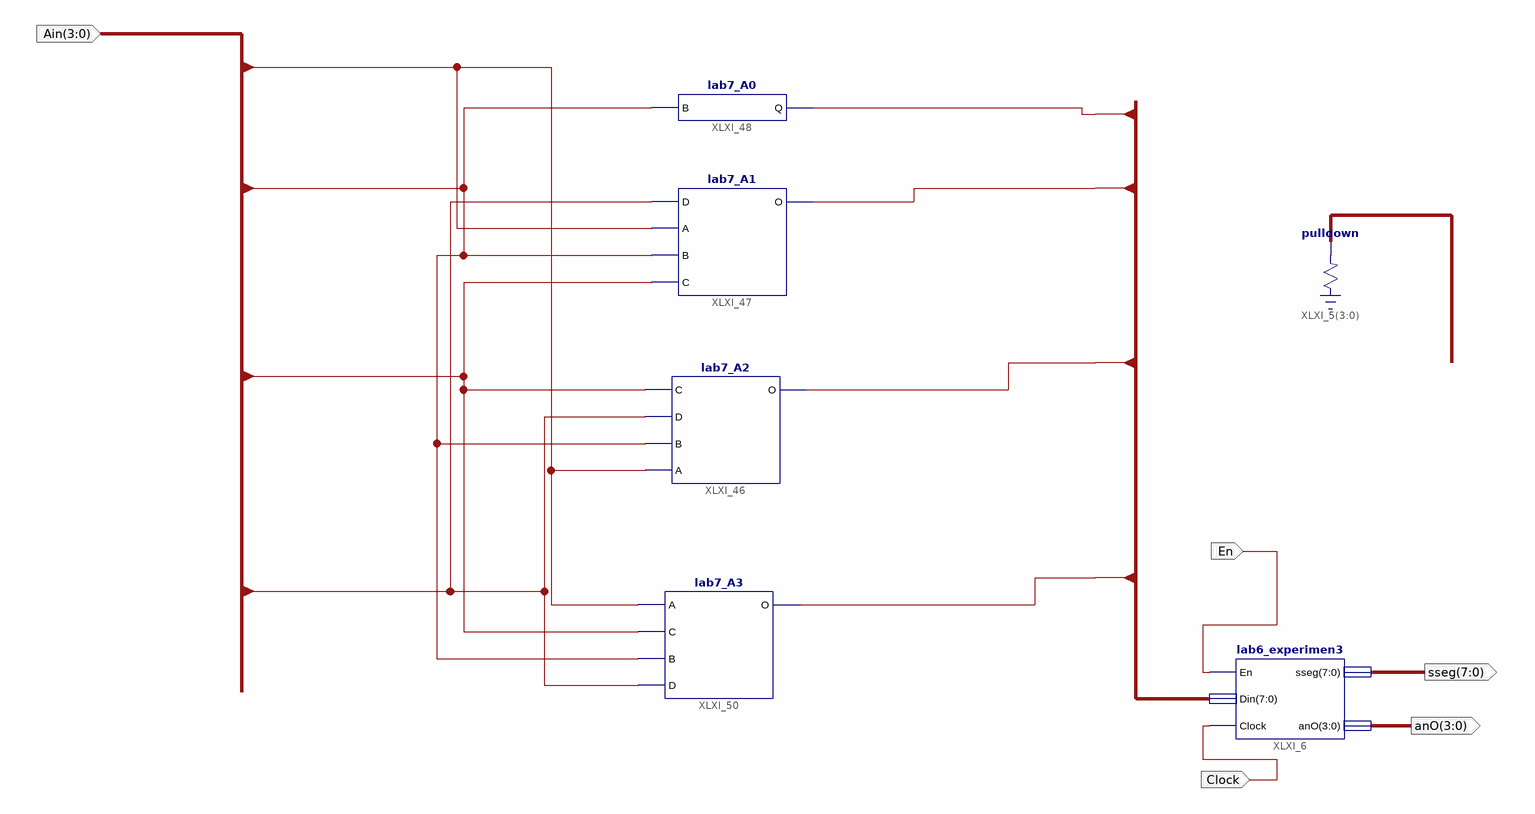
[diagram p0: schematic sheet 1]
// Xilinx ISE schematic lab6_experiment7_graycode.sch (spartan3e) as structural Verilog: 6 symbols, 5 ports
module lab6_experiment7_graycode (
  input  En,
  input  Clock,
  input  [3:0] Ain,
  output [7:0] sseg,
  output [3:0] anO
);

  wire [7:0] Din;

  \pulldown  XLXI_5[3:0] (.O(Din[7:4]));
  lab6_experimen3 XLXI_6 (.En(En), .Din(Din), .Clock(Clock), .sseg(sseg), .anO(anO));
  lab7_A2 XLXI_46 (.C(Ain[2]), .D(Ain[3]), .B(Ain[1]), .A(Ain[0]), .O(Din[2]));
  lab7_A1 XLXI_47 (.D(Ain[3]), .A(Ain[0]), .B(Ain[1]), .C(Ain[2]), .O(Din[1]));
  lab7_A0 XLXI_48 (.B(Ain[1]), .Q(Din[0]));
  lab7_A3 XLXI_50 (.A(Ain[0]), .C(Ain[2]), .B(Ain[1]), .D(Ain[3]), .O(Din[3]));
endmodule
